# Altium schematic sheet QDRII_mem.SchDoc
size A3
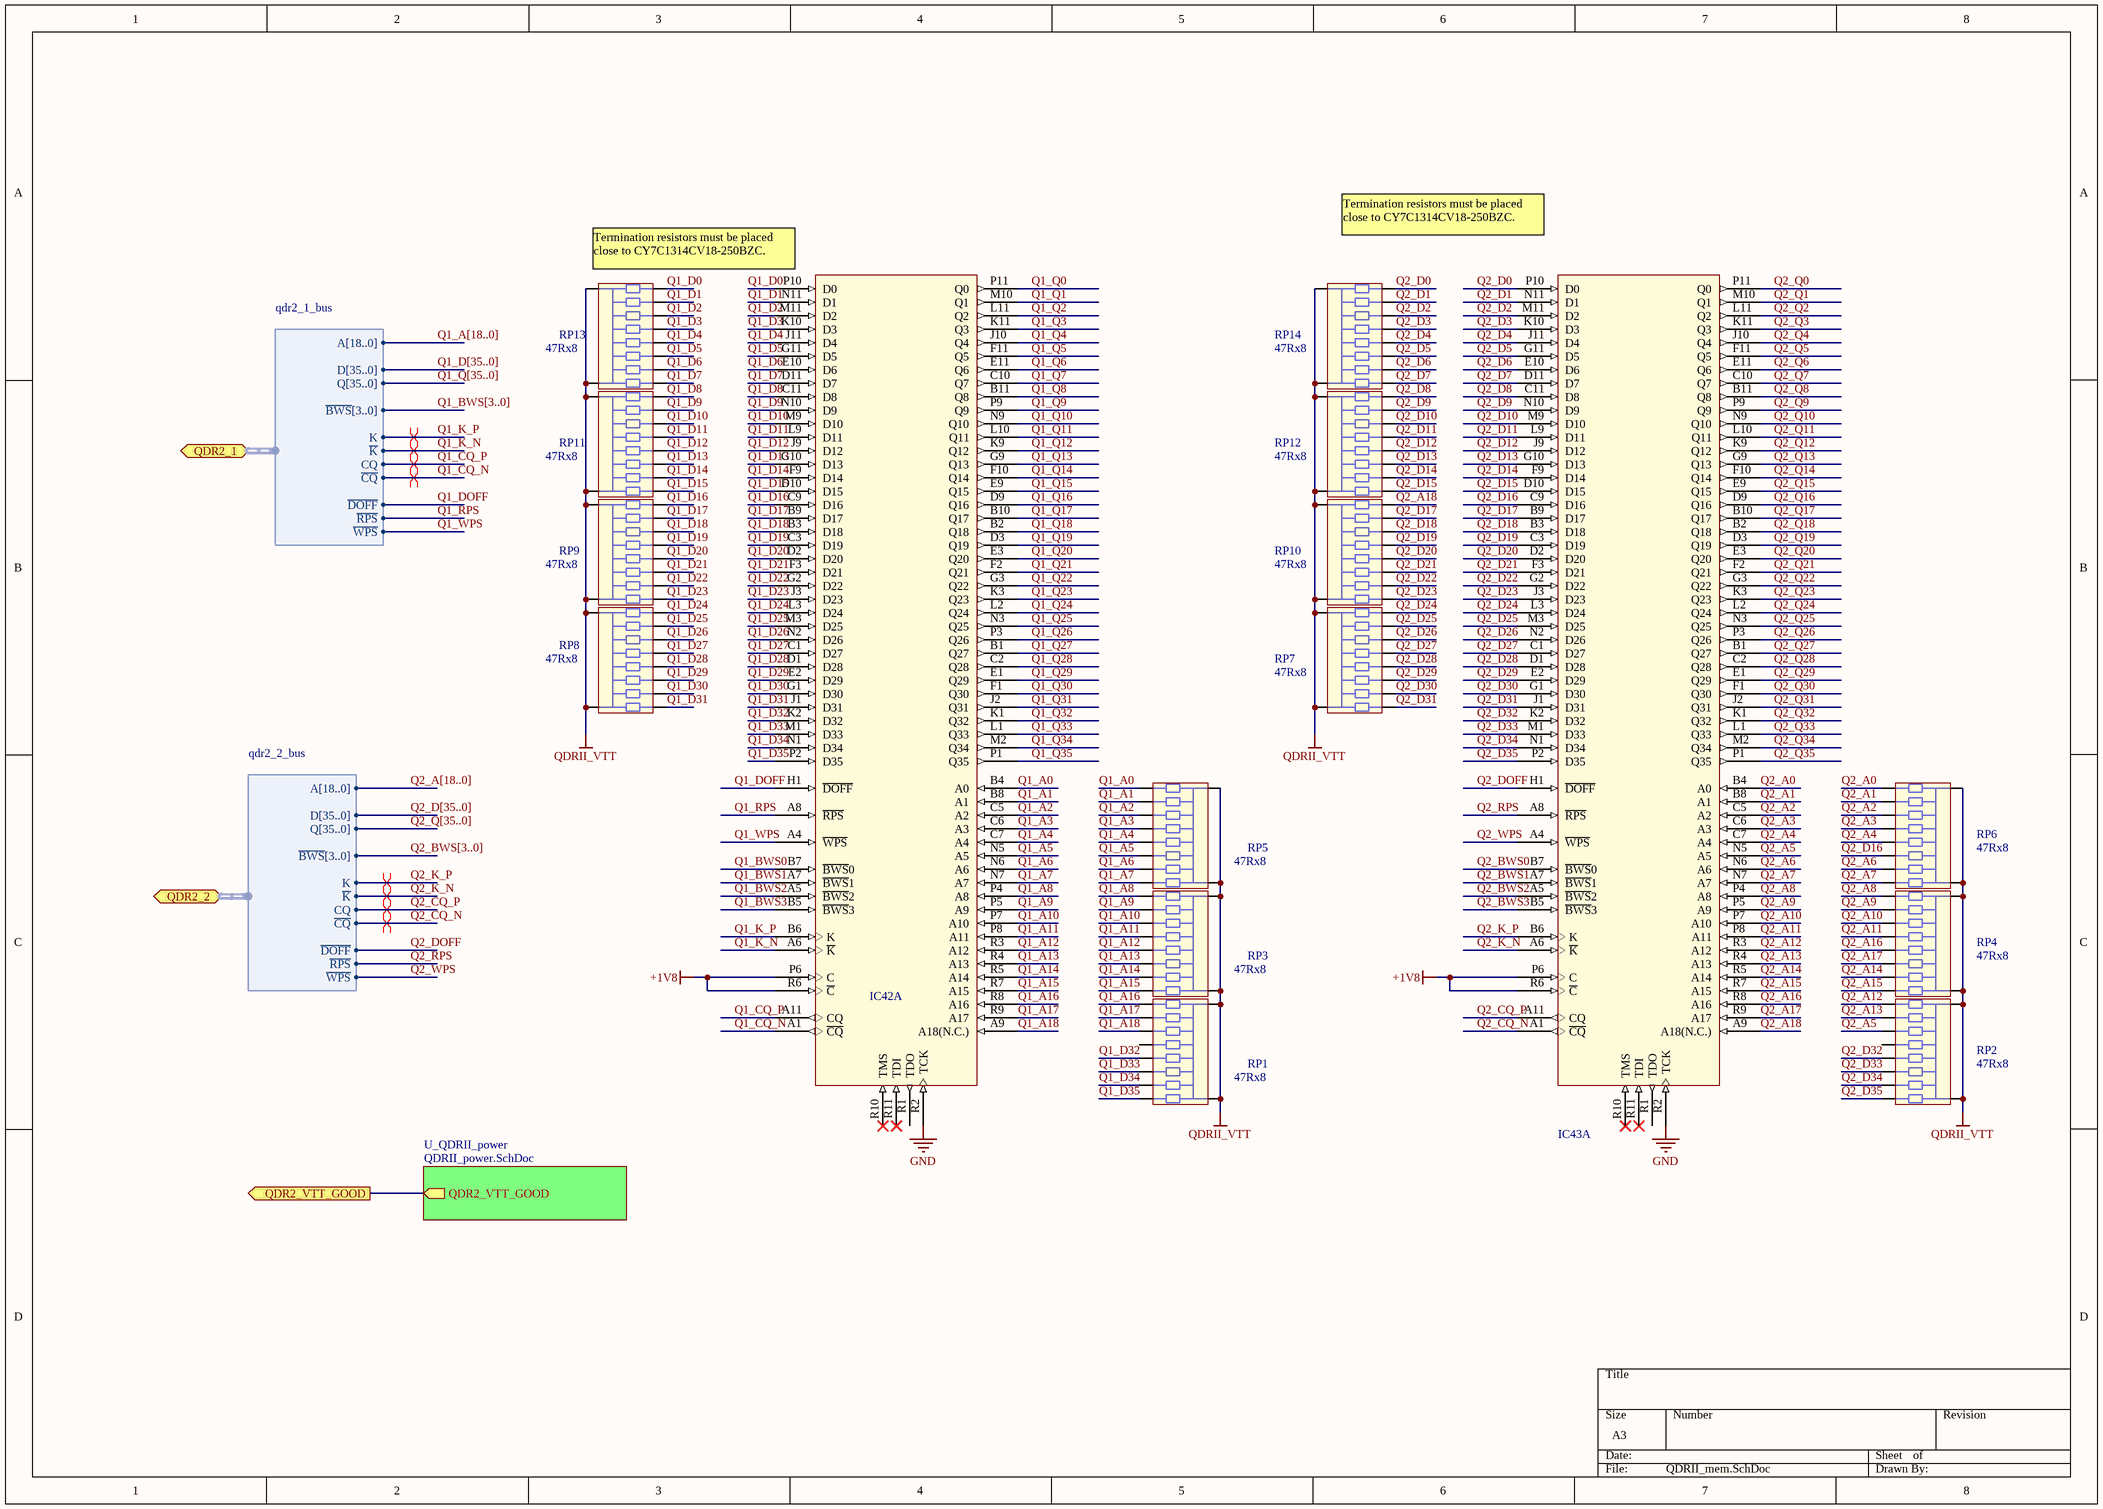
[diagram p0: QDRII_mem.SchDoc]

## Parts
IC42  CY7C1314CV18-250BZC  [BGA165C100P11X15_1300X1500X140]  (value not drawn)  (part A of 2)
IC43  CY7C1314CV18-250BZC  [BGA165C100P11X15_1300X1500X140]  (value not drawn)  (part A of 2)
RP1  value 47Rx8  [EXBE]  (hidden comment: 47R x 8)
RP2  value 47Rx8  [EXBE]  (hidden comment: 47R x 8)
RP3  value 47Rx8  [EXBE]  (hidden comment: 47R x 8)
RP4  value 47Rx8  [EXBE]  (hidden comment: 47R x 8)
RP5  value 47Rx8  [EXBE]  (hidden comment: 47R x 8)
RP6  value 47Rx8  [EXBE]  (hidden comment: 47R x 8)
RP7  value 47Rx8  [EXBE]  (hidden comment: 47R x 8)
RP8  value 47Rx8  [EXBE]  (hidden comment: 47R x 8)
RP9  value 47Rx8  [EXBE]  (hidden comment: 47R x 8)
RP10  value 47Rx8  [EXBE]  (hidden comment: 47R x 8)
RP11  value 47Rx8  [EXBE]  (hidden comment: 47R x 8)
RP12  value 47Rx8  [EXBE]  (hidden comment: 47R x 8)
RP13  value 47Rx8  [EXBE]  (hidden comment: 47R x 8)
RP14  value 47Rx8  [EXBE]  (hidden comment: 47R x 8)

## Sub-sheets
U_QDRII_power = QDRII_power.SchDoc: QDR2_VTT_GOOD (out)

## Ports
QDR2_1 (harness qdr2_1_bus), QDR2_2 (harness qdr2_2_bus), QDR2_VTT_GOOD (out)

## Harnesses
qdr2_2_bus: A[18..0], ~{BWS}[3..0], ~{CQ}, CQ, D[35..0], ~{DOFF}, K, ~{K}, Q[35..0], ~{RPS}, ~{WPS}
qdr2_1_bus: A[18..0], ~{BWS}[3..0], ~{CQ}, CQ, D[35..0], ~{DOFF}, K, ~{K}, Q[35..0], ~{RPS}, ~{WPS}

## Nets
+1V8: IC42.P6(C) IC42.R6(~{C}) IC43.P6(C) IC43.R6(~{C})
GND: IC42.R2(TCK) IC43.R2(TCK)
QDRII_VTT: RP1.1 RP1.6 RP2.1 RP2.6 RP3.1 RP3.6 RP4.1 RP4.6 RP5.1 RP5.6 RP6.1 RP6.6 RP7.1 RP7.6 RP8.1 RP8.6 RP9.1 RP9.6 RP10.1 RP10.6 RP11.1 RP11.6 RP12.1 RP12.6 RP13.1 RP13.6 RP14.1 RP14.6
Q1_A0: IC42.B4(A0) RP5.2
Q1_A1: IC42.B8(A1) RP5.3
Q1_A2: IC42.C5(A2) RP5.4
Q1_A3: IC42.C6(A3) RP5.5
Q1_A4: IC42.C7(A4) RP5.7
Q1_A5: IC42.N5(A5) RP5.8
Q1_A6: IC42.N6(A6) RP5.9
Q1_A7: IC42.N7(A7) RP5.10
Q1_A8: IC42.P4(A8) RP3.2
Q1_A9: IC42.P5(A9) RP3.3
Q1_A10: IC42.P7(A10) RP3.4
Q1_A11: IC42.P8(A11) RP3.5
Q1_A12: IC42.R3(A12) RP3.7
Q1_A13: IC42.R4(A13) RP3.8
Q1_A14: IC42.R5(A14) RP3.9
Q1_A15: IC42.R7(A15) RP3.10
Q1_A16: IC42.R8(A16) RP1.2
Q1_A17: IC42.R9(A17) RP1.3
Q1_A18: IC42.A9(A18(N.C.)) RP1.4
Q1_BWS0: IC42.B7(~{BWS}0)
Q1_BWS1: IC42.A7(~{BWS}1)
Q1_BWS2: IC42.A5(~{BWS}2)
Q1_BWS3: IC42.B5(~{BWS}3)
Q1_CQ_N: IC42.A1(~{CQ}) ; port QDR2_1.~{CQ}
Q1_CQ_P: IC42.A11(CQ) ; port QDR2_1.CQ
Q1_D0: IC42.P10(D0) RP13.10
Q1_D1: IC42.N11(D1) RP13.9
Q1_D2: IC42.M11(D2) RP13.8
Q1_D3: IC42.K10(D3) RP13.7
Q1_D4: IC42.J11(D4) RP13.5
Q1_D5: IC42.G11(D5) RP13.4
Q1_D6: IC42.E10(D6) RP13.3
Q1_D7: IC42.D11(D7) RP13.2
Q1_D8: IC42.C11(D8) RP11.10
Q1_D9: IC42.N10(D9) RP11.9
Q1_D10: IC42.M9(D10) RP11.8
Q1_D11: IC42.L9(D11) RP11.7
Q1_D12: IC42.J9(D12) RP11.5
Q1_D13: IC42.G10(D13) RP11.4
Q1_D14: IC42.F9(D14) RP11.3
Q1_D15: IC42.D10(D15) RP11.2
Q1_D16: IC42.C9(D16) RP9.10
Q1_D17: IC42.B9(D17) RP9.9
Q1_D18: IC42.B3(D18) RP9.8
Q1_D19: IC42.C3(D19) RP9.7
Q1_D20: IC42.D2(D20) RP9.5
Q1_D21: IC42.F3(D21) RP9.4
Q1_D22: IC42.G2(D22) RP9.3
Q1_D23: IC42.J3(D23) RP9.2
Q1_D24: IC42.L3(D24) RP8.10
Q1_D25: IC42.M3(D25) RP8.9
Q1_D26: IC42.N2(D26) RP8.8
Q1_D27: IC42.C1(D27) RP8.7
Q1_D28: IC42.D1(D28) RP8.5
Q1_D29: IC42.E2(D29) RP8.4
Q1_D30: IC42.G1(D30) RP8.3
Q1_D31: IC42.J1(D31) RP8.2
Q1_D32: IC42.K2(D32) RP1.7
Q1_D33: IC42.M1(D33) RP1.8
Q1_D34: IC42.N1(D34) RP1.9
Q1_D35: IC42.P2(D35) RP1.10
Q1_DOFF: IC42.H1(~{DOFF}) ; port QDR2_1.~{DOFF}
Q1_K_N: IC42.A6(~{K}) ; port QDR2_1.~{K}
Q1_K_P: IC42.B6(K) ; port QDR2_1.K
Q1_Q0: IC42.P11(Q0)
Q1_Q1: IC42.M10(Q1)
Q1_Q2: IC42.L11(Q2)
Q1_Q3: IC42.K11(Q3)
Q1_Q4: IC42.J10(Q4)
Q1_Q5: IC42.F11(Q5)
Q1_Q6: IC42.E11(Q6)
Q1_Q7: IC42.C10(Q7)
Q1_Q8: IC42.B11(Q8)
Q1_Q9: IC42.P9(Q9)
Q1_Q10: IC42.N9(Q10)
Q1_Q11: IC42.L10(Q11)
Q1_Q12: IC42.K9(Q12)
Q1_Q13: IC42.G9(Q13)
Q1_Q14: IC42.F10(Q14)
Q1_Q15: IC42.E9(Q15)
Q1_Q16: IC42.D9(Q16)
Q1_Q17: IC42.B10(Q17)
Q1_Q18: IC42.B2(Q18)
Q1_Q19: IC42.D3(Q19)
Q1_Q20: IC42.E3(Q20)
Q1_Q21: IC42.F2(Q21)
Q1_Q22: IC42.G3(Q22)
Q1_Q23: IC42.K3(Q23)
Q1_Q24: IC42.L2(Q24)
Q1_Q25: IC42.N3(Q25)
Q1_Q26: IC42.P3(Q26)
Q1_Q27: IC42.B1(Q27)
Q1_Q28: IC42.C2(Q28)
Q1_Q29: IC42.E1(Q29)
Q1_Q30: IC42.F1(Q30)
Q1_Q31: IC42.J2(Q31)
Q1_Q32: IC42.K1(Q32)
Q1_Q33: IC42.L1(Q33)
Q1_Q34: IC42.M2(Q34)
Q1_Q35: IC42.P1(Q35)
Q1_RPS: IC42.A8(~{RPS}) ; port QDR2_1.~{RPS}
Q1_WPS: IC42.A4(~{WPS}) ; port QDR2_1.~{WPS}
Q2_A0: IC43.B4(A0) RP6.5
Q2_A1: IC43.B8(A1) RP6.10
Q2_A2: IC43.C5(A2) RP6.7
Q2_A3: IC43.C6(A3) RP6.8
Q2_A4: IC43.C7(A4) RP6.9
Q2_A5: IC43.N5(A5) RP2.9
Q2_A6: IC43.N6(A6) RP6.3
Q2_A7: IC43.N7(A7) RP6.4
Q2_A8: IC43.P4(A8) RP4.10
Q2_A9: IC43.P5(A9) RP4.9
Q2_A10: IC43.P7(A10) RP4.5
Q2_A11: IC43.P8(A11) RP4.3
Q2_A12: IC43.R3(A12) RP2.10
Q2_A13: IC43.R4(A13) RP2.7
Q2_A14: IC43.R5(A14) RP4.8
Q2_A15: IC43.R7(A15) RP4.7
Q2_A16: IC43.R8(A16) RP4.4
Q2_A17: IC43.R9(A17) RP4.2
Q2_A18: IC43.A9(A18(N.C.)) RP10.5
Q2_BWS0: IC43.B7(~{BWS}0)
Q2_BWS1: IC43.A7(~{BWS}1)
Q2_BWS2: IC43.A5(~{BWS}2)
Q2_BWS3: IC43.B5(~{BWS}3)
Q2_CQ_N: IC43.A1(~{CQ}) ; port QDR2_2.~{CQ}
Q2_CQ_P: IC43.A11(CQ) ; port QDR2_2.CQ
Q2_D0: IC43.P10(D0) RP14.10
Q2_D1: IC43.N11(D1) RP14.9
Q2_D2: IC43.M11(D2) RP14.8
Q2_D3: IC43.K10(D3) RP14.7
Q2_D4: IC43.J11(D4) RP14.5
Q2_D5: IC43.G11(D5) RP14.4
Q2_D6: IC43.E10(D6) RP14.3
Q2_D7: IC43.D11(D7) RP14.2
Q2_D8: IC43.C11(D8) RP12.10
Q2_D9: IC43.N10(D9) RP12.9
Q2_D10: IC43.M9(D10) RP12.8
Q2_D11: IC43.L9(D11) RP12.7
Q2_D12: IC43.J9(D12) RP12.5
Q2_D13: IC43.G10(D13) RP12.4
Q2_D14: IC43.F9(D14) RP12.3
Q2_D15: IC43.D10(D15) RP12.2
Q2_D16: IC43.C9(D16) RP6.2
Q2_D17: IC43.B9(D17) RP10.4
Q2_D18: IC43.B3(D18) RP10.10
Q2_D19: IC43.C3(D19) RP10.9
Q2_D20: IC43.D2(D20) RP10.8
Q2_D21: IC43.F3(D21) RP10.2
Q2_D22: IC43.G2(D22) RP10.7
Q2_D23: IC43.J3(D23) RP10.3
Q2_D24: IC43.L3(D24) RP7.4
Q2_D25: IC43.M3(D25) RP7.3
Q2_D26: IC43.N2(D26) RP7.2
Q2_D27: IC43.C1(D27) RP7.10
Q2_D28: IC43.D1(D28) RP7.9
Q2_D29: IC43.E2(D29) RP7.8
Q2_D30: IC43.G1(D30) RP7.7
Q2_D31: IC43.J1(D31) RP7.5
Q2_D32: IC43.K2(D32) RP2.5
Q2_D33: IC43.M1(D33) RP2.4
Q2_D34: IC43.N1(D34) RP2.3
Q2_D35: IC43.P2(D35) RP2.2
Q2_DOFF: IC43.H1(~{DOFF}) ; port QDR2_2.~{DOFF}
Q2_K_N: IC43.A6(~{K}) ; port QDR2_2.~{K}
Q2_K_P: IC43.B6(K) ; port QDR2_2.K
Q2_Q0: IC43.P11(Q0)
Q2_Q1: IC43.M10(Q1)
Q2_Q2: IC43.L11(Q2)
Q2_Q3: IC43.K11(Q3)
Q2_Q4: IC43.J10(Q4)
Q2_Q5: IC43.F11(Q5)
Q2_Q6: IC43.E11(Q6)
Q2_Q7: IC43.C10(Q7)
Q2_Q8: IC43.B11(Q8)
Q2_Q9: IC43.P9(Q9)
Q2_Q10: IC43.N9(Q10)
Q2_Q11: IC43.L10(Q11)
Q2_Q12: IC43.K9(Q12)
Q2_Q13: IC43.G9(Q13)
Q2_Q14: IC43.F10(Q14)
Q2_Q15: IC43.E9(Q15)
Q2_Q16: IC43.D9(Q16)
Q2_Q17: IC43.B10(Q17)
Q2_Q18: IC43.B2(Q18)
Q2_Q19: IC43.D3(Q19)
Q2_Q20: IC43.E3(Q20)
Q2_Q21: IC43.F2(Q21)
Q2_Q22: IC43.G3(Q22)
Q2_Q23: IC43.K3(Q23)
Q2_Q24: IC43.L2(Q24)
Q2_Q25: IC43.N3(Q25)
Q2_Q26: IC43.P3(Q26)
Q2_Q27: IC43.B1(Q27)
Q2_Q28: IC43.C2(Q28)
Q2_Q29: IC43.E1(Q29)
Q2_Q30: IC43.F1(Q30)
Q2_Q31: IC43.J2(Q31)
Q2_Q32: IC43.K1(Q32)
Q2_Q33: IC43.L1(Q33)
Q2_Q34: IC43.M2(Q34)
Q2_Q35: IC43.P1(Q35)
Q2_RPS: IC43.A8(~{RPS}) ; port QDR2_2.~{RPS}
Q2_WPS: IC43.A4(~{WPS}) ; port QDR2_2.~{WPS}
QDR2_VTT_GOOD: port QDR2_VTT_GOOD, sheet U_QDRII_power/QDR2_VTT_GOOD

Not connected (* = marked no-connect by the designer): IC42 R1(TDO) R10(TMS)* R11(TDI)*; IC43 R1(TDO) R10(TMS)* R11(TDI)*; RP1 5; RP2 8

## Buses and harness runs
bus Q1_A[18..0]
bus Q1_BWS[3..0]
bus Q1_D[35..0]
bus Q1_Q[35..0]
bus Q2_A[18..0]
bus Q2_BWS[3..0]
bus Q2_D[35..0]
bus Q2_Q[35..0]

## Layout directives
differential pair: Q1_CQ_N, Q1_CQ_P, Q1_K_N, Q1_K_P, Q2_CQ_N, Q2_CQ_P, Q2_K_N, Q2_K_P

## Notes on the sheet
- Termination resistors must be placed close to CY7C1314CV18-250BZC.

## Library data of the parts
IC42 IC43 = CY7C1314CV18: 18-Mbit (512Kx36) QDRII SRAM 2-Word Burst Architecture; Value: CY7C1314CV18-250BZC; Distributor1 PN: CY7C1314CV18-250BZC -ND; Distributor1: Digikey
RP1-RP14 = EXB-E10C470J: 47R, 62.5mW Chip Resistor Bussed Network; Manufacturer1: Panasonic; Tolerance: ±5%; TCR: 200ppm; Case: EXBE; Manufacturer1 PN: EXB-E10C470J; Distributor1: DigiKey; Distributor1 PN: U8470CT-ND; Power Rating: 62.5mW